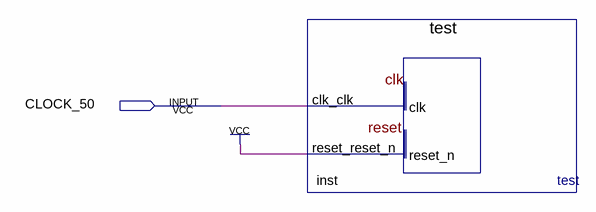
[diagram p0: schematic sheet]
// Quartus schematic sudokis.bdf as structural Verilog: 1 symbols, 1 pins
module sudokis (
  input  CLOCK_50
);

  test inst (.clk_clk(CLOCK_50), .reset_reset_n(1'b1));
endmodule
